# EAGLE design SolenoidSwitcher (EAGLE 9.4.2)
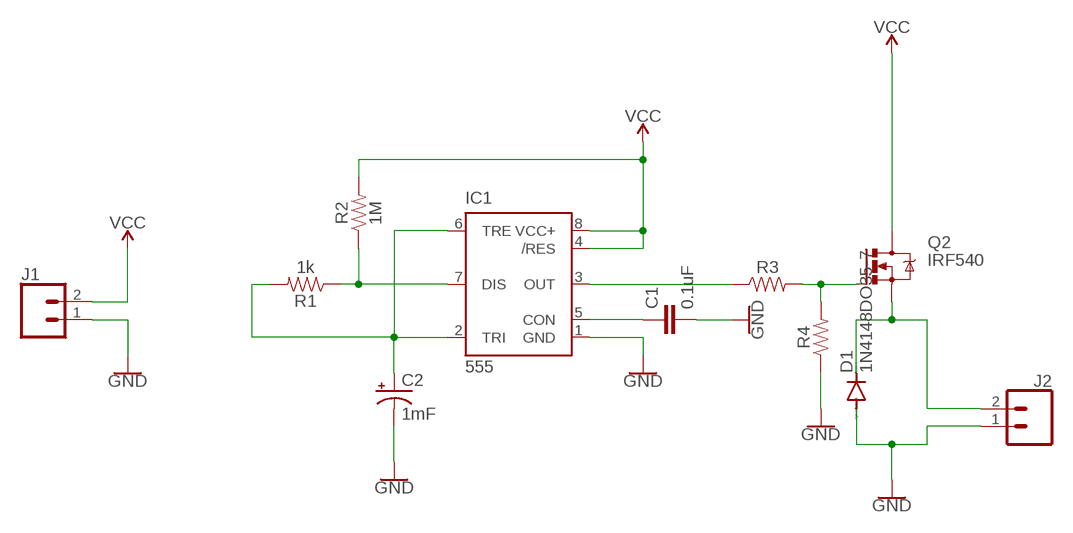
[diagram p0: schematic, sheet 1]

## Parts
C1  0.1uF  0.1UF-KIT-EZ-50V-20%  [CAP-PTH-SMALL-KIT]
C2  1mF  1000UF-RADIAL-5MM-25V-20%  [CPOL-RADIAL-5MM-10MM]
D1  1N4148DO35-7  [DO35-7]
IC1  555  555P  [DIP08]
J1  CONN_02  [1X02]
J2  CONN_02  [1X02]
Q2  IRF540  [TO220BV]
R1  1k  1KOHM-VERT-1/4W-1%  [AXIAL-0.1]
R2  1M  1MOHM-VERT-1/4W-5%  [AXIAL-0.1]
R3  RESISTORAXIAL-0.3  [AXIAL-0.3]
R4  RESISTORAXIAL-0.3  [AXIAL-0.3]

## Nets
GND: C1.2 C2.- D1.A IC1.1(GND) J1.1 J2.1 R4.P$1
N$1: IC1.3(OUT) R3.P$1
N$2: C2.+ IC1.2(TRI) IC1.6(TRE) R1.P$2
N$3: Q2.G R3.P$2 R4.P$2
N$4: C1.1 IC1.5(CON)
N$5: IC1.7(DIS) R1.P$1 R2.P$1
N$6: D1.C J2.2 Q2.S
VCC: IC1.4(/RES) IC1.8(VCC+) J1.2 Q2.D R2.P$2

## Library data of the parts
C1 = SparkFun-Capacitors:0.1UF: 0.1µF ceramic capacitors A capacitor is a passive two-terminal electrical component used to store electrical energy temporarily in an electric field.; PROD_ID: CAP-08370
C2 = SparkFun-Capacitors:1000UF: 1,000µF/1mF ceramic capacitors A capacitor is a passive two-terminal electrical component used to store electrical energy temporarily in an electric field. CAP-08070; PROD_ID: CAP-09538
D1 = diode:1N4148: DIODE high speed (Philips)
IC1 = SparkFun-IC-Special-Function:555: General purpose bipolar Timer Datasheet <http://www.sparkfun.com/datasheets/Components/General/ne555.pdf> SparkFun Products SparkFun SparkPunk Sequencer Kit <https://www.sparkfun.com/products/12707> (KIT-12707) Storefront Component: 555 Timer <https://www.sparkfun.com/products/9273> (COM-09273) Two parts valid for production: VFP: IC-11930 (M7555 PTH) VFP: IC-09173 (555 PTH) - Preferred; PROD_ID: IC-09173; PROD_ID_ALT: IC-09173
J1 J2 = SparkFun-Connectors:CONN_02: Multi connection point. Often used as Generic Header-pin footprint for 0.1 inch spaced/style header connections On any of the 0.1 inch spaced packages, you can populate with these: Break Away Headers - Straight <https://www.sparkfun.com/products/116> (PRT-00116) Break Away Male Headers - Right Angle <https://www.sparkfun.com/products/553> (PRT-00553) Female Headers <https://www.sparkfun.com/products/115> (PRT-00115) Break Away Headers - Machine Pin <https://www.sparkfun.com/products/117> (PRT-00117) Break Away Female Headers - Swiss Machine Pin <https://www.sparkfun.com/products/743> (PRT-00743) For SCREWTERMINALS and SPRING TERMINALS visit here: Screw Terimnals on SparkFun.com <https://www.sparkfun.com/search/results?term=Screw+Terminals> (5mm/3.5mm/2.54mm spacing) This device is also useful as a general connection point to wire up your design to another part of your project. Our various solder wires solder well into these plated through hole pads. Hook-Up Wire - Assortment (Stranded, 22 AWG) <https://www.sparkfun.com/products/11375> (PRT-11375) Hook-Up Wire - Assortment (Solid Core, 22 AWG) <https://www.sparkfun.com/products/11367> (PRT-11367) View the entire wire category on our website here <https://www.sparkfun.com/categories/141> Special notes: Molex polarized connector foot print use with: PRT-08233 with associated crimp pins and housings. 2.54_SCREWTERM for use with PRT-10571. 3.5mm Screw Terminal footprints for PRT-08084 5mm Screw Terminal footprints for use with PRT-08432
Q2 = transistor-power:IRF540: HEXFET Power MOSFET
R1 = SparkFun-Resistors:1KOHM: 1kΩ resistor A resistor is a passive two-terminal electrical component that implements electrical resistance as a circuit element. Resistors act to reduce current flow, and, at the same time, act to lower voltage levels within circuits. - Wikipedia; PROD_ID: RES-12182
R2 = SparkFun-Resistors:1MOHM: 1MΩ resistor A resistor is a passive two-terminal electrical component that implements electrical resistance as a circuit element. Resistors act to reduce current flow, and, at the same time, act to lower voltage levels within circuits. - Wikipedia; PROD_ID: RES-09329
R3 R4 = SparkFun-Resistors:RESISTOR: Generic Resistor Package

## Net classes
0 default: width 1.016 mm, clearance 1.016 mm
1 220V: width 2.286 mm, clearance 2.286 mm

## Board
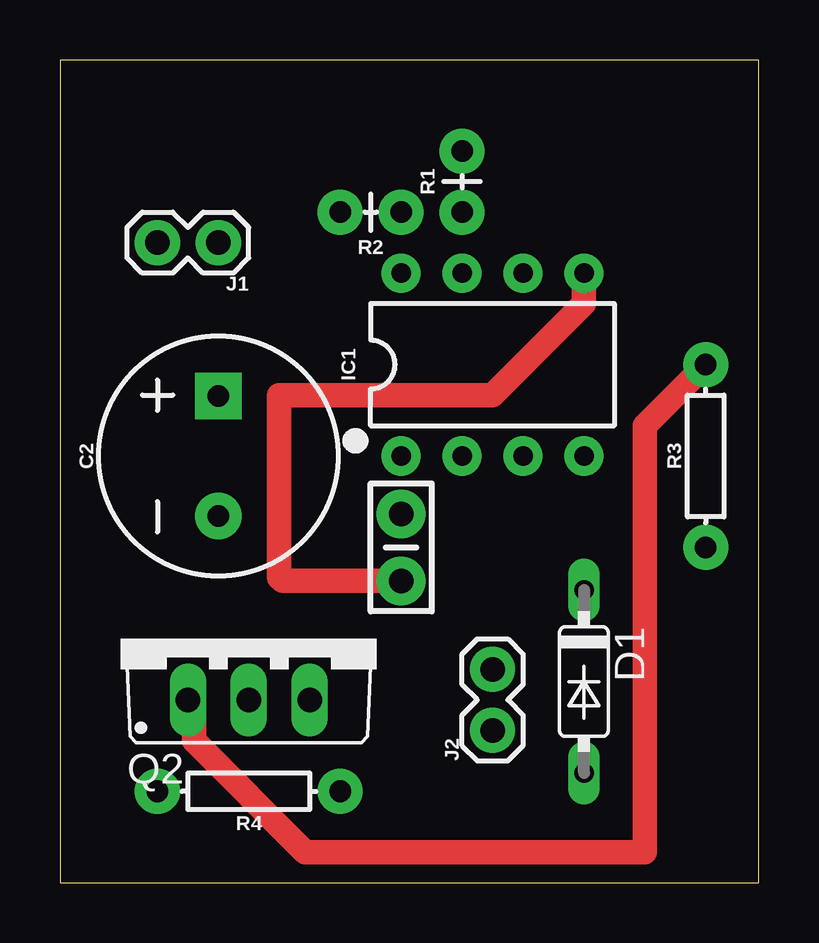
[diagram p1: board, top side]
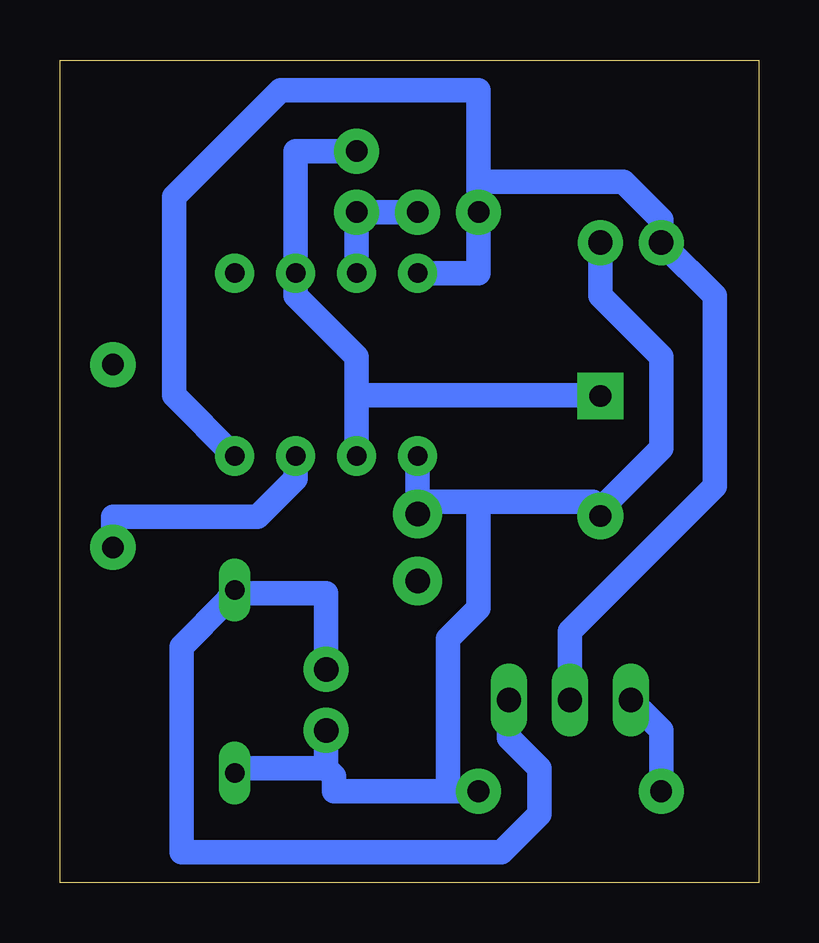
[diagram p2: board, bottom side, seen from below]

Size 29.13 x 34.28 mm. Coordinates in mm from the lower left corner, seen from the top.
Outline: 0,0 29.13,0 29.13,34.28 0,34.28 0,0
Copper layers (1*16): Top 0.035mm / dielectric 1.5mm / Bottom 0.035mm
Design rules "default *": minimum track width 6mil, minimum drill 0.35mm, track to track 6mil, track to pad 6mil, pad to pad 6mil, via to via 6mil, smd to smd 6mil, copper to edge 20mil, drill to drill 6mil, minimum pad ring 10mil, minimum via ring 8mil, stop-mask expansion 4mil, vias tented up to drill 0mil, thermal gap 10mil

### Footprints (pad centres in the part's own frame; a part is rotated, then mirrored left to right if it is on the bottom)
CAP-PTH-SMALL-KIT = drill 1.016 pad 2.032: 1 -1.397,0; 2 1.397,0
CPOL-RADIAL-5MM-10MM = drill 0.9 pad 1.93 square: + 2.5,0 | drill 0.9 pad 1.93: - -2.5,0
DO35-7 = drill 0.813 long: A 3.81,0; C -3.81,0
DIP08 = drill 0.813 pad 1.626: 1 -3.81,-3.81; 2 -1.27,-3.81; 3 1.27,-3.81; 4 3.81,-3.81; 5 3.81,3.81; 6 1.27,3.81; 7 -1.27,3.81; 8 -3.81,3.81
1X02 = drill 1.016 pad 1.88: 1 0,0; 2 2.54,0
TO220BV = drill 1.016 long: D 0,-2.54; G -2.54,-2.54; S 2.54,-2.54
AXIAL-0.1 = drill 0.9 pad 1.88: P$1 -1.27,0; P$2 1.27,0
AXIAL-0.3 = drill 0.9 pad 1.88: P$1 -3.81,0; P$2 3.81,0

### Placement (x,y rotation side)
C1  14.22,13.97 90 top
C2  6.6,17.78 90 top
D1  21.84,8.38 270 top
IC1  18.03,21.59 0 top
J1  6.6,26.67 180 top
J2  18.03,6.35 90 top
Q2  7.87,10.16 0 top
R1  16.76,29.21 90 top
R2  12.95,27.94 180 top
R3  26.92,17.78 90 top
R4  7.87,3.81 180 top

### Tracks (layer width: path | path; a pad name or v marks a point on that pad's centre or on a via)
GND
  Bottom 1.016: 18.03,4.76 21.84,4.76 D1.A | J2.1 18.03,4.76 | 12.95,3.81 17.72,3.81 17.72,4.44 18.03,4.76 | 12.95,3.81 R4.P$1 | IC1.1 C1.2 13.91,15.87 11.68,15.87 | J1.1 6.6,24.45 4.06,21.91 4.06,18.1 6.6,15.56 C2.- 6.92,15.87 11.68,15.87 | 12.95,3.81 12.95,10.16 11.68,11.43 11.68,15.87
N$1
  Bottom 1.016: IC1.3 19.3,16.83 20.89,15.24 26.92,15.24 R3.P$1
N$2
  Bottom 1.016: 16.76,20.32 16.76,21.91 19.3,24.45 IC1.6 19.3,30.48 R1.P$2 | 16.76,20.32 IC1.2 | 16.76,20.32 6.6,20.32 C2.+
N$3
  Top 1.016: Q2.G 5.59,7.37 5.59,5.91 10.23,1.27 24.38,1.27 24.38,19.05 R3.P$2
  Bottom 1.016: Q2.G 4.06,6.35 R4.P$2
N$4
  Top 1.016: IC1.5 21.84,24.13 18.03,20.32 9.14,20.32 9.14,12.7 9.27,12.57 C1.1
N$5
  Bottom 1.016: IC1.7 R1.P$1 R2.P$1
N$6
  Bottom 1.016: J2.2 18.03,12.06 21.84,12.06 D1.C 22.16,11.75 24.07,9.84 24.07,1.27 10.73,1.27 9.14,2.86 9.14,4.76 10.41,6.03 Q2.S
VCC
  Bottom 1.016: Q2.D 7.87,10.48 1.84,16.51 1.84,24.45 J1.2 4.06,27.62 5.65,29.21 11.68,29.21 | IC1.8 11.68,25.4 R2.P$2 11.68,29.21 | IC1.4 24.38,20.32 24.38,28.57 19.94,33.02 11.68,33.02 11.68,29.21